# EAGLE schematic ESP32 Display 3.5 inch V1.2(1) (EAGLE 9.6.2)
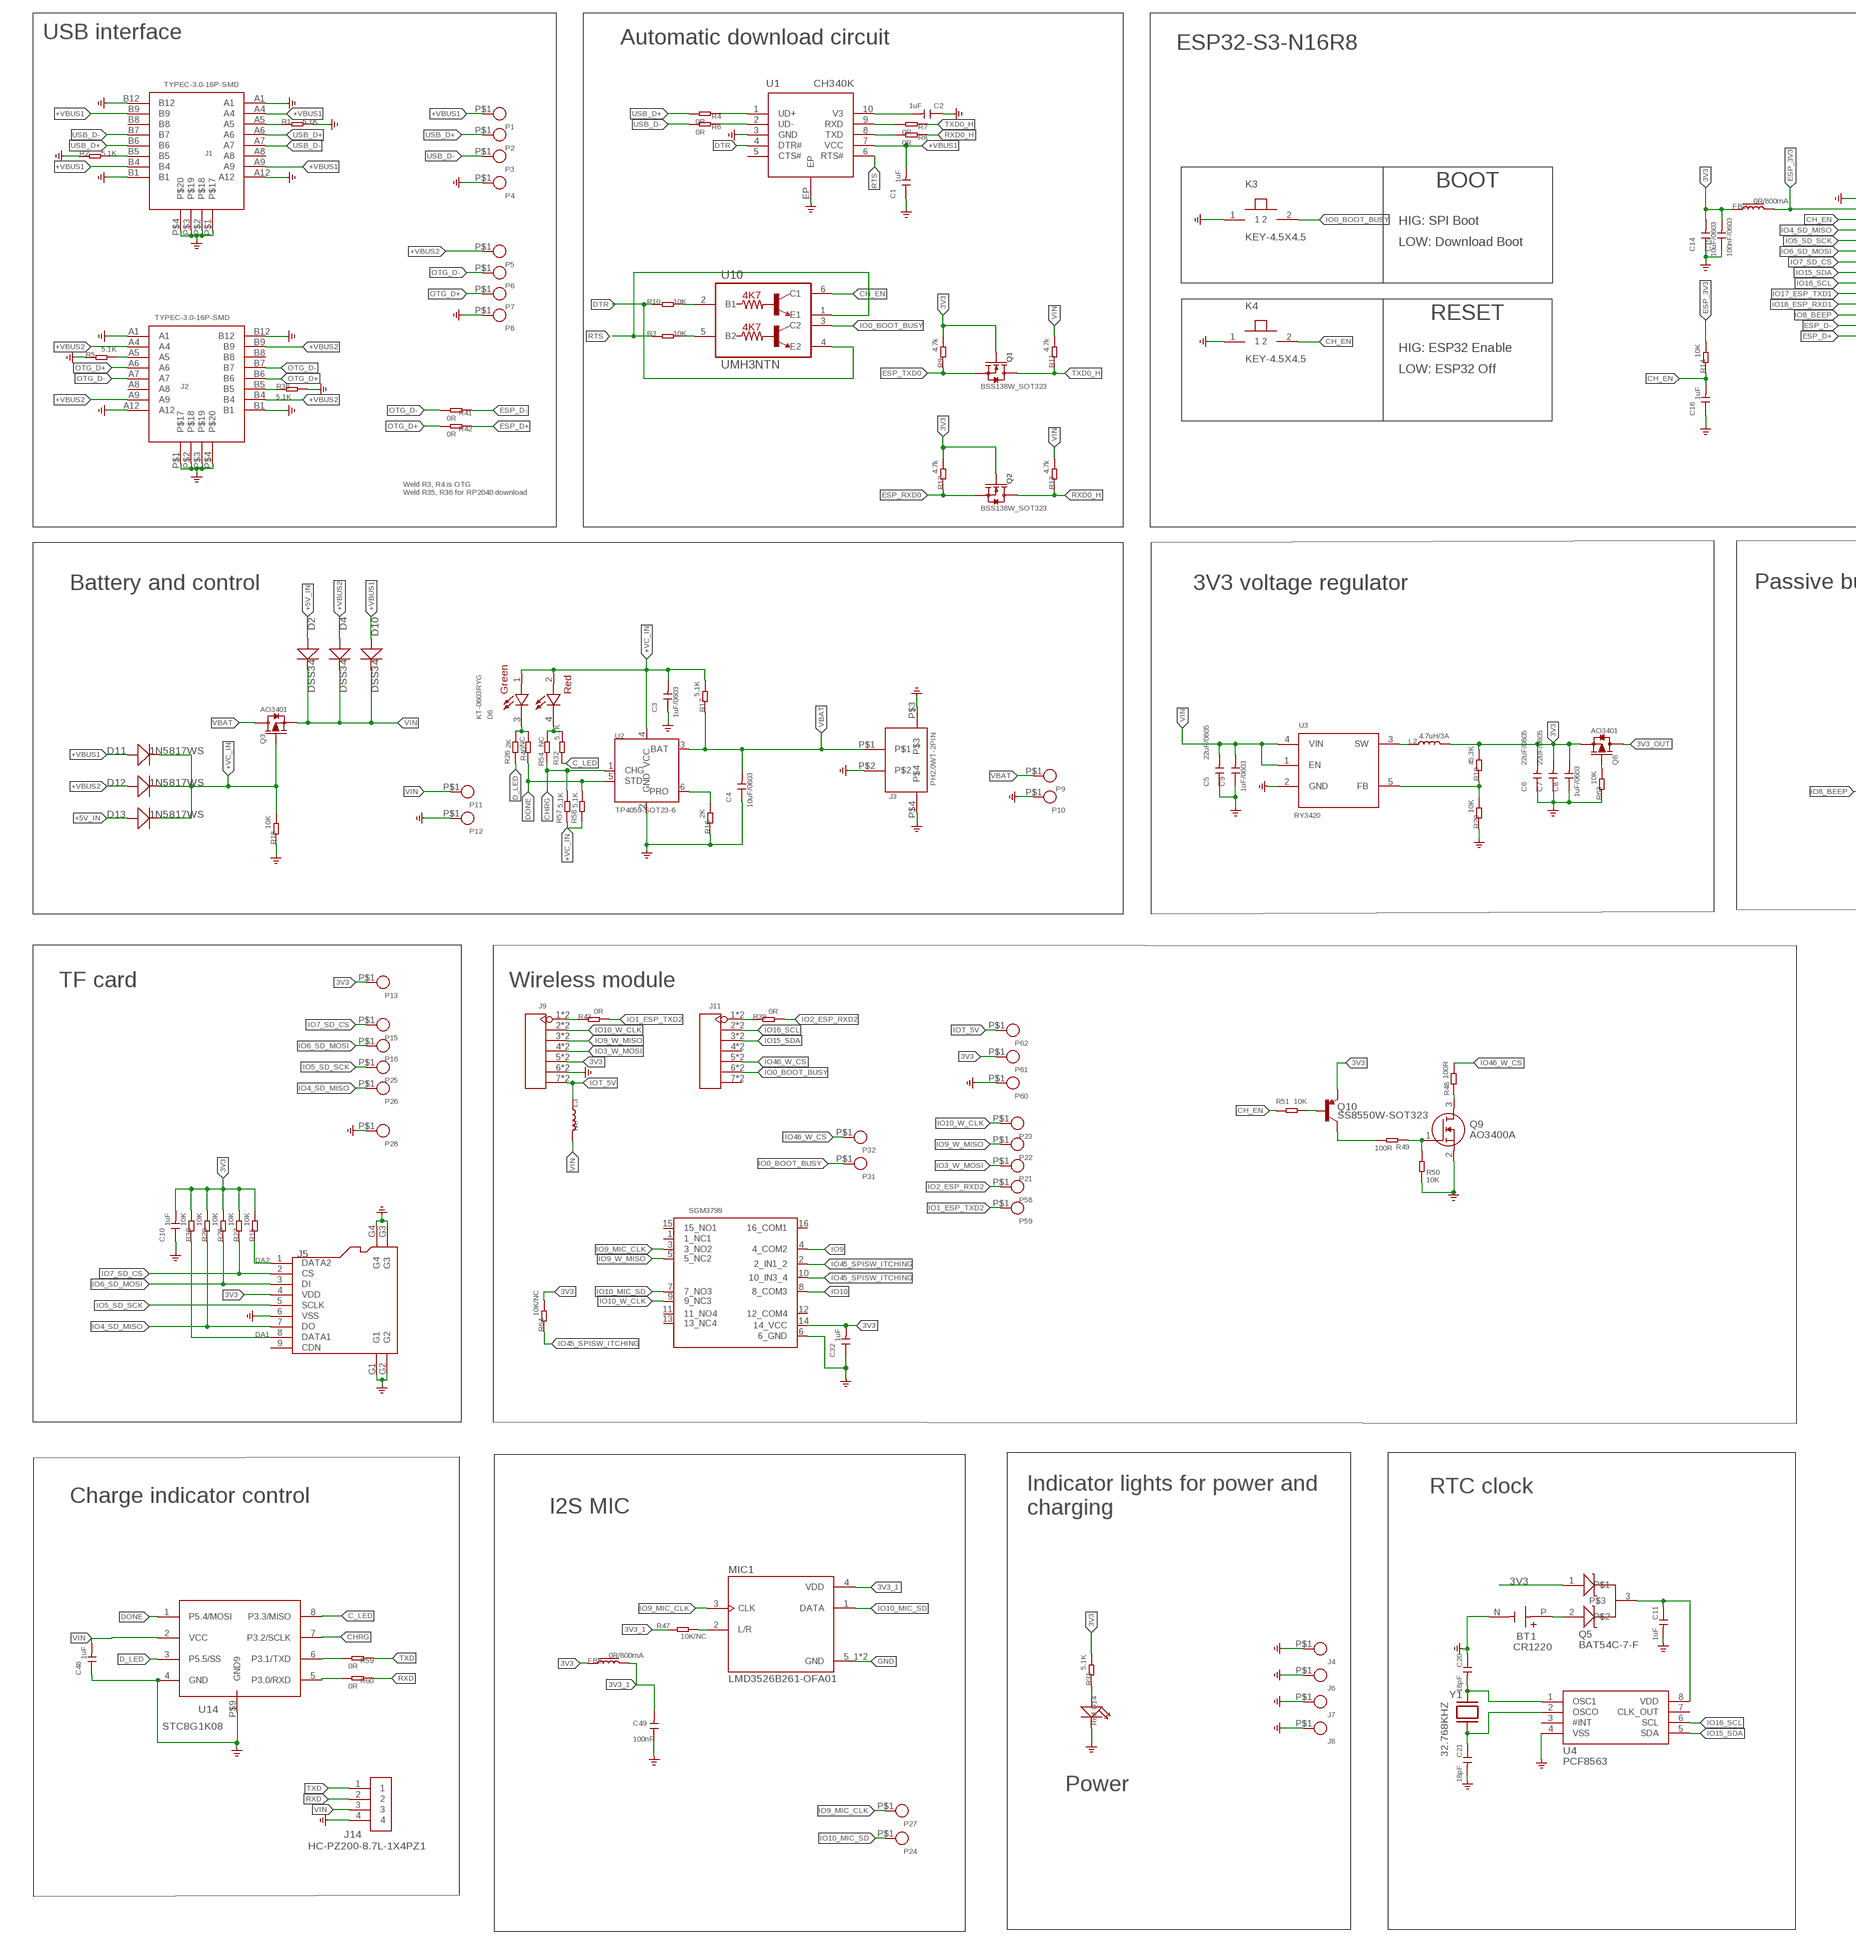
[diagram p0: schematic, sheet 1, part 1 of 3]
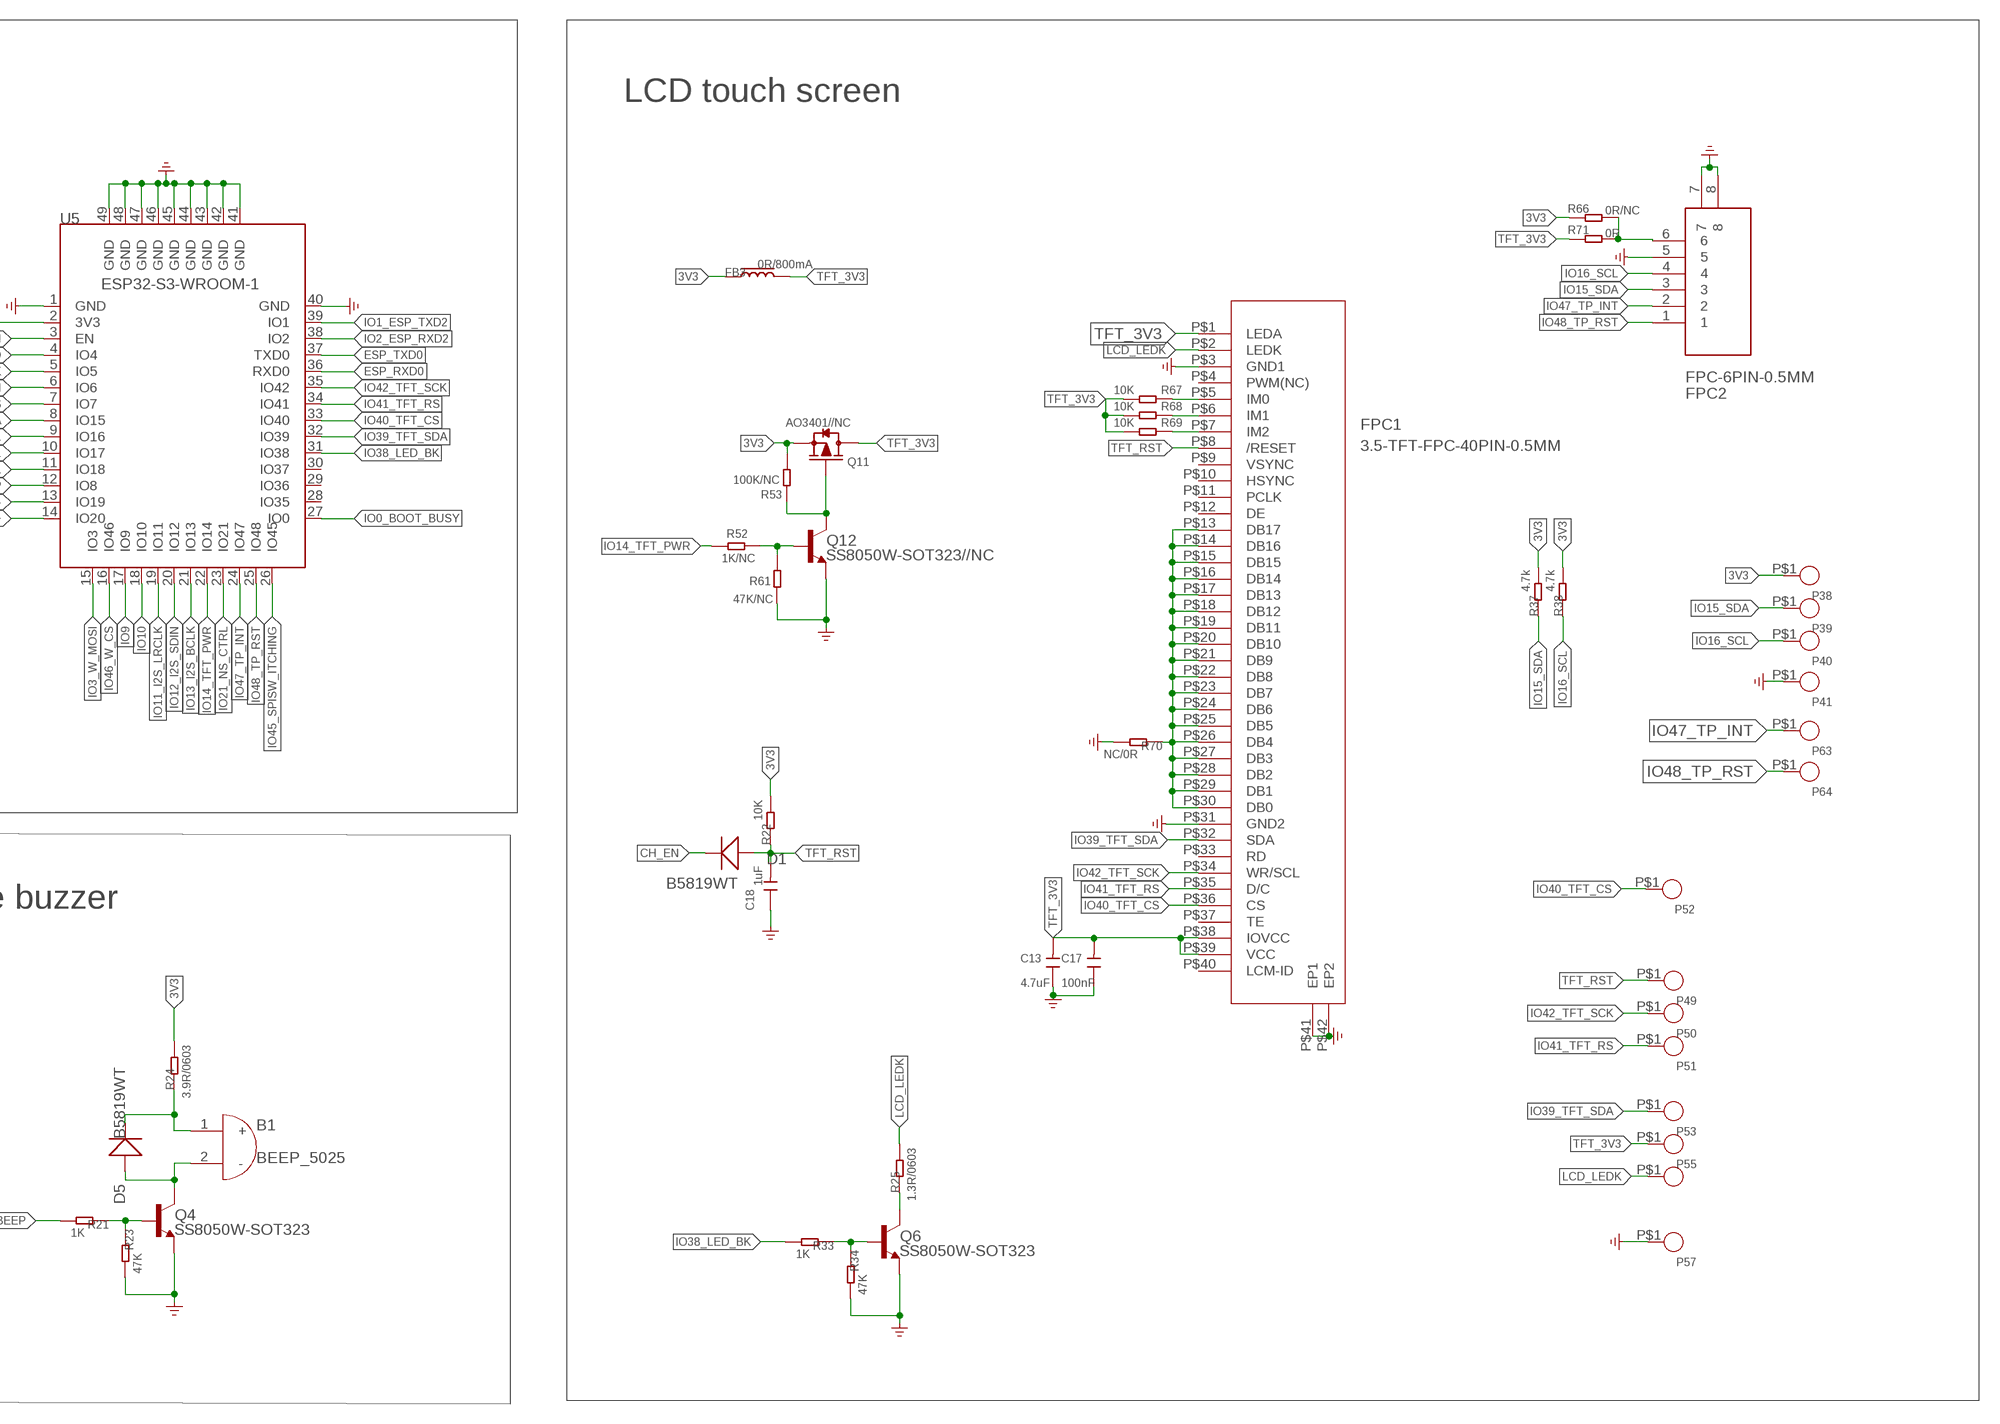
[diagram p1: schematic, sheet 1, part 2 of 3]
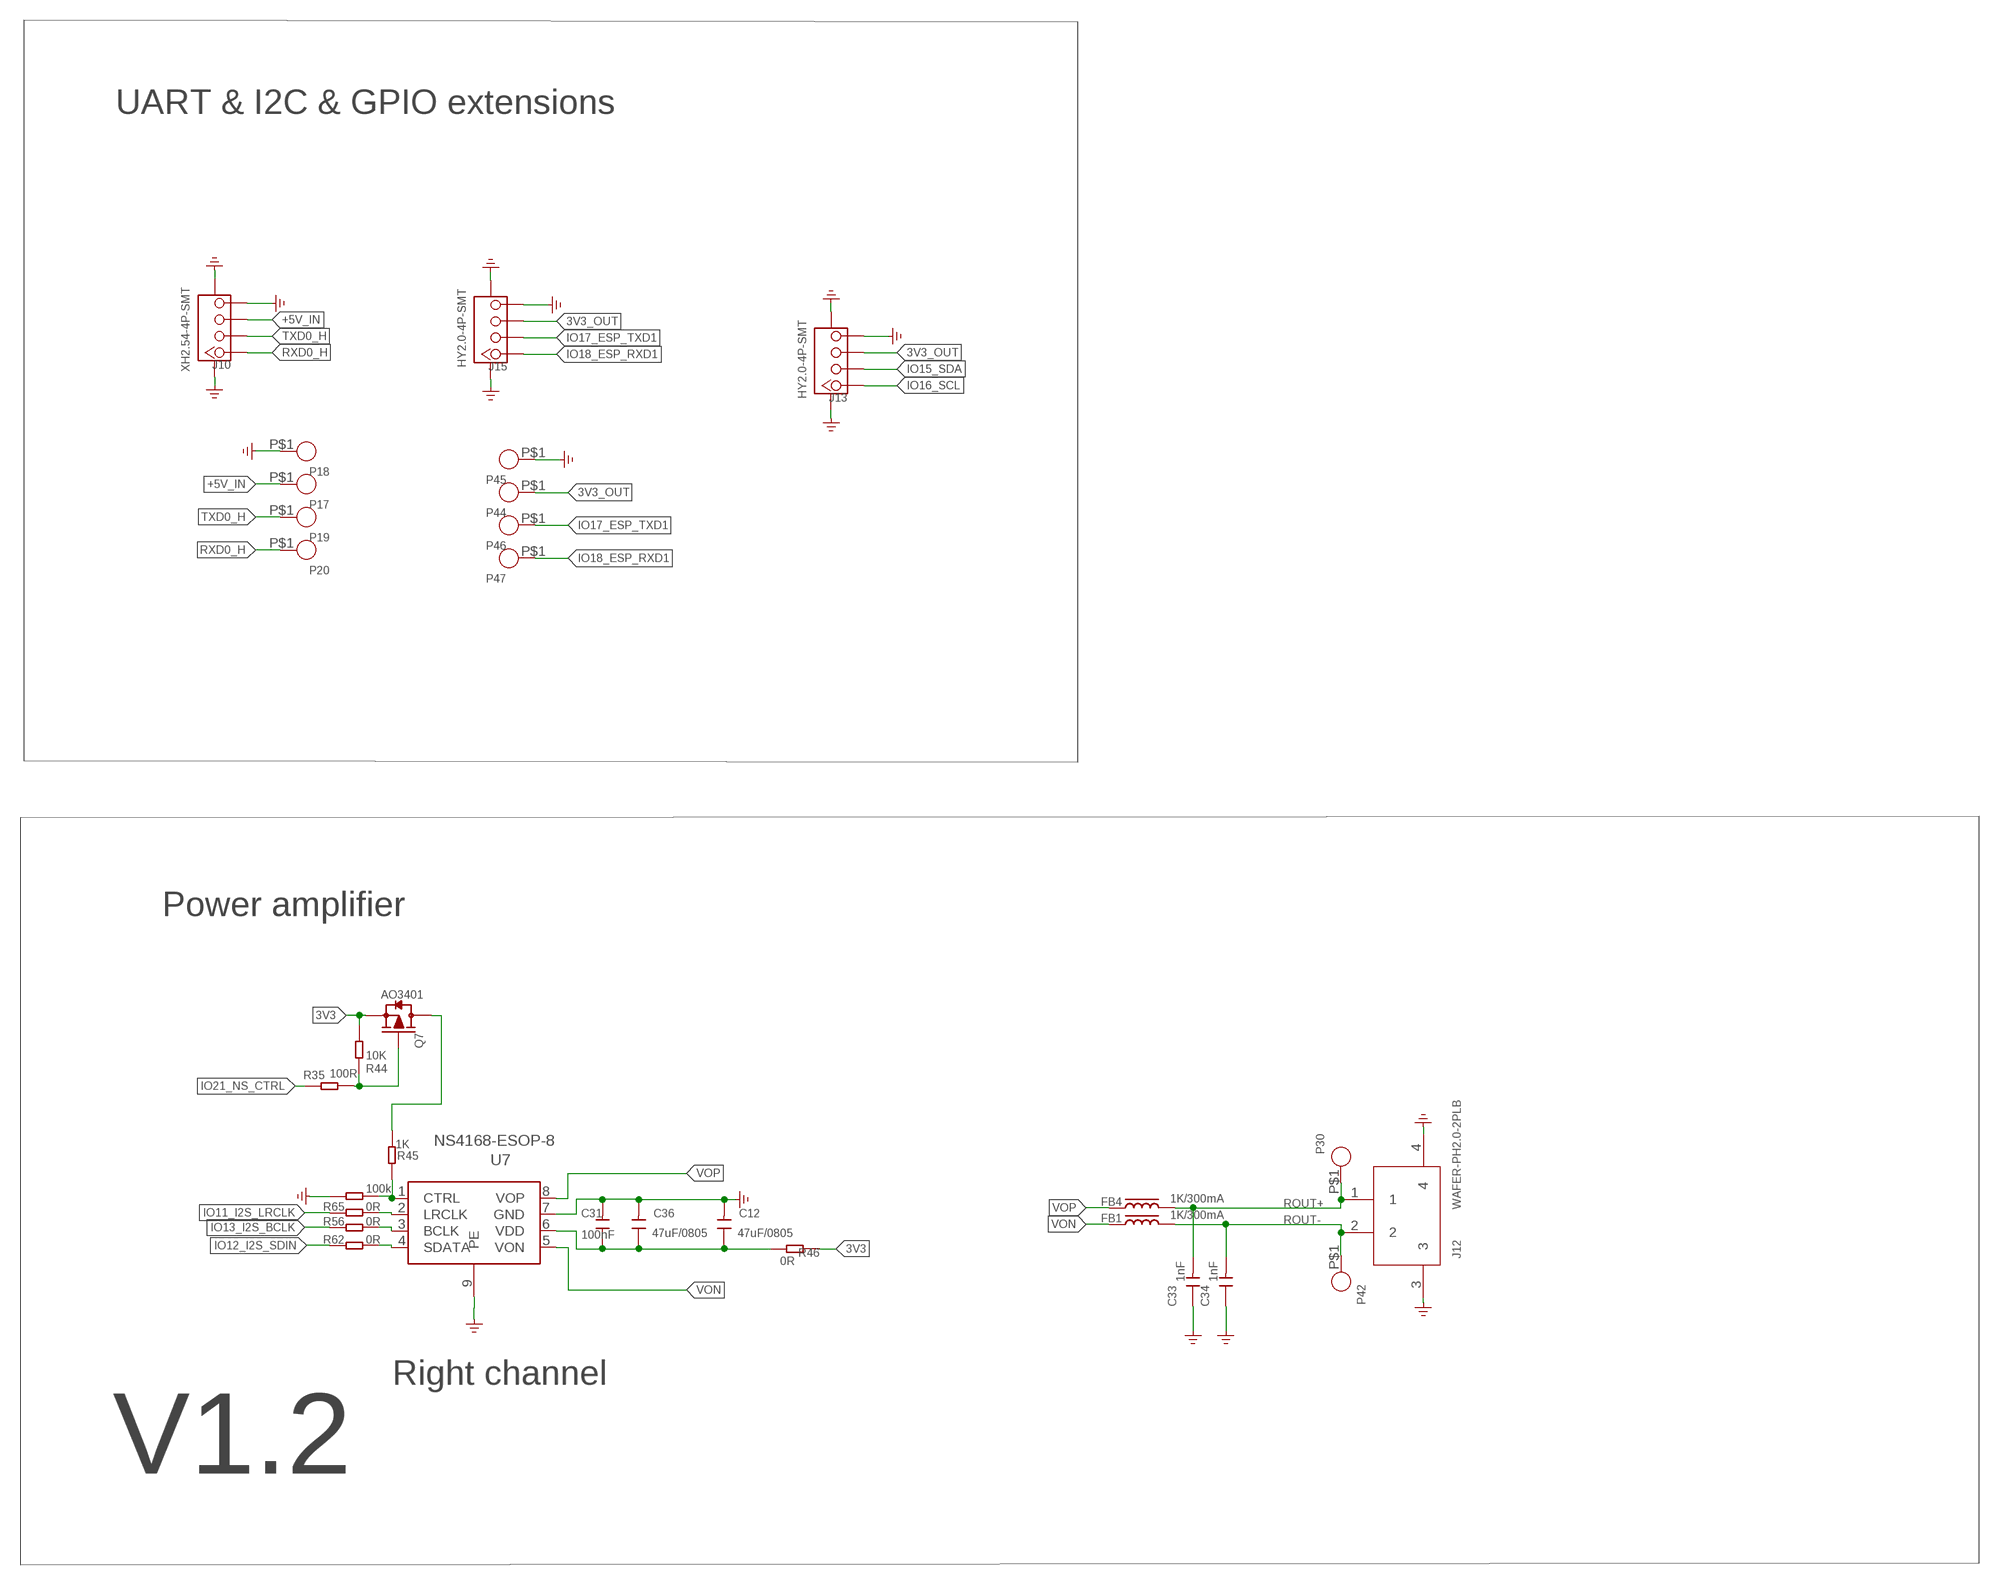
[diagram p2: schematic, sheet 1, part 3 of 3]

## Parts
B1  BEEP_5025  [BEEP_5025]
BT1  CR1220  [CR1220]
C1  1uF  CAPC0402-1  [C0402]
C2  1uF  CAPC0402-1  [C0402]
C3  1uF/0603  CAP  [C0603]
C4  10uF/0603  CAP  [C0603]
C5  22uF/0805  CAPC0805  [C0805]
C6  22uF/0805  CAPC0805  [C0805]
C7  22uF/0805  CAPC0805  [C0805]
C8  1uF/0603  CAP  [C0603]
C9  1uF/0603  CAP  [C0603]
C10  1uF  CAPC0402-1  [C0402]
C11  1uF  CAPC0402-1  [C0402]
C12  47uF/0805  CAPC0805  [C0805]
C13  4.7uF  CAP  [C0603]
C14  10uF/0603  CAP  [C0603]
C15  100nF/0603  CAP  [C0603]
C16  1uF  CAPC0402-1  [C0402]
C17  100nF  CAP  [C0603]
C18  1uF  CAPC0402-1  [C0402]
C20  18pF  CAPC0402-1  [C0402]
C21  18pF  CAPC0402-1  [C0402]
C31  100nF  CAPC0402-1  [C0402]
C32  1uF  CAPC0402-1  [C0402]
C33  1nF  CAPC0402-1  [C0402]
C34  1nF  CAPC0402-1  [C0402]
C36  47uF/0805  CAPC0805  [C0805]
C48  1uF  CAPC0402-1  [C0402]
C49  100nF  CAP  [C0603]
D1  B5819WT  DIODE0603  [D_SOD523]
D2  DSS34  DIODE  [D_SOD123FL]
D4  DSS34  DIODE  [D_SOD123FL]
D5  B5819WT  DIODE0603  [D_SOD523]
D6  KT-0603RYG  [LED_KT-0603RYG]
D10  DSS34  DIODE  [D_SOD123FL]
D11  1N5817WS  DIODE0805  [D_SOD323]
D12  1N5817WS  DIODE0805  [D_SOD323]
D13  1N5817WS  DIODE0805  [D_SOD323]
D14  Red  LED-SMT0603  [LED0603]
FB1  1K/300mA  FBL0603  [L0603]
FB2  0R/800mA  FBL0603  [L0603]
FB3  0R/800mA  FBL0603  [L0603]
FB4  1K/300mA  FBL0603  [L0603]
FB5  0R/800mA  FBL0603  [L0603]
FPC1  3.5-TFT-FPC-40PIN-0.5MM  [COOPER_0.5MM*40P]
FPC2  FPC-6PIN-0.5MM  [FPC-6PIN-0.5MM]
J1  TYPEC-3.0-16P-SMD  [USB-3.0TYPEC-SMD]
J2  TYPEC-3.0-16P-SMD  [USB-3.0TYPEC-SMD]
J3  PH2.0WT-2PIN  [PH2.0WT-2PIN]
J4  THO-M3.25MM-HOLE  [THO-M3.2*5MM-HOLE]
J5  HOLDER-MICROSD-9P  [9P-SMD-W/-RING]
J6  THO-M3.25MM-HOLE  [THO-M3.2*5MM-HOLE]
J7  THO-M3.25MM-HOLE  [THO-M3.2*5MM-HOLE]
J8  THO-M3.25MM-HOLE  [THO-M3.2*5MM-HOLE]
J9  HEADER-7P-18.28X2.5  [H7-2.54-18.28X2.5X5MM]
J10  XH2.54-4P-SMT  [XH2.54-4P-SMD]
J11  HEADER-7P-18.28X2.5  [H7-2.54-18.28X2.5X5MM]
J12  WAFER-PH2.0-2PLB  [CONN-TH_2P-P2.00_XUNPU_WAFER-PH2.0-2PLB]
J13  HY2.0-4P-SMT  CONNECTOR_TWIG-4P-2.0-SMD-FEMALE-REINFORCEDD  [CONNECTOR_4P-SMD-2.0]
J14  HC-PZ200-8.7L-1X4PZ1  [TEST-PIN-4-2.0MM]
J15  HY2.0-4P-SMT  CONNECTOR_TWIG-4P-2.0-SMD-FEMALE-REINFORCEDD  [CONNECTOR_4P-SMD-2.0]
K3  KEY-4.5X4.5  KEY-6KEY-4.5X4.5  [KEY-4.5X4.5-SMD]
K4  KEY-4.5X4.5  KEY-6KEY-4.5X4.5  [KEY-4.5X4.5-SMD]
L2  4.7uH/3A  LL0420  [L0420]
L3  NC  L0603  [L0603]
MIC1  LMD3526B261-OFA01  LMD3526B261-OFA03  [MIC-SMD_5P-L3.5-W2.7-P1.67]
P1  TEST_PADPAD-1.5MM  [TEST_PAD-1.5MM]
P2  TEST_PADPAD-1.5MM  [TEST_PAD-1.5MM]
P3  TEST_PADPAD-1.5MM  [TEST_PAD-1.5MM]
P4  TEST_PADPAD-1.5MM  [TEST_PAD-1.5MM]
P5  TEST_PADPAD-1.5MM  [TEST_PAD-1.5MM]
P6  TEST_PADPAD-1.5MM  [TEST_PAD-1.5MM]
P7  TEST_PADPAD-1.5MM  [TEST_PAD-1.5MM]
P8  TEST_PADPAD-1.5MM  [TEST_PAD-1.5MM]
P9  TEST_PADPAD-1.5MM  [TEST_PAD-1.5MM]
P10  TEST_PADPAD-1.5MM  [TEST_PAD-1.5MM]
P11  TEST_PADPAD-1.5MM  [TEST_PAD-1.5MM]
P12  TEST_PADPAD-1.5MM  [TEST_PAD-1.5MM]
P13  TEST_PADPAD-1.5MM  [TEST_PAD-1.5MM]
P15  TEST_PADPAD-1.5MM  [TEST_PAD-1.5MM]
P16  TEST_PADPAD-1.5MM  [TEST_PAD-1.5MM]
P17  TEST_PADPAD-1.5MM  [TEST_PAD-1.5MM]
P18  TEST_PADPAD-1.5MM  [TEST_PAD-1.5MM]
P19  TEST_PADPAD-1.5MM  [TEST_PAD-1.5MM]
P20  TEST_PADPAD-1.5MM  [TEST_PAD-1.5MM]
P21  TEST_PADPAD-1.5MM  [TEST_PAD-1.5MM]
P22  TEST_PADPAD-1.5MM  [TEST_PAD-1.5MM]
P23  TEST_PADPAD-1.5MM  [TEST_PAD-1.5MM]
P24  TEST_PADPAD-1.5MM  [TEST_PAD-1.5MM]
P25  TEST_PADPAD-1.5MM  [TEST_PAD-1.5MM]
P26  TEST_PADPAD-1.5MM  [TEST_PAD-1.5MM]
P27  TEST_PADPAD-1.5MM  [TEST_PAD-1.5MM]
P28  TEST_PADPAD-1.5MM  [TEST_PAD-1.5MM]
P30  TEST_PADPAD-1.5MM  [TEST_PAD-1.5MM]
P31  TEST_PADPAD-1.5MM  [TEST_PAD-1.5MM]
P32  TEST_PADPAD-1.5MM  [TEST_PAD-1.5MM]
P38  TEST_PADPAD-1.5MM  [TEST_PAD-1.5MM]
P39  TEST_PADPAD-1.5MM  [TEST_PAD-1.5MM]
P40  TEST_PADPAD-1.5MM  [TEST_PAD-1.5MM]
P41  TEST_PADPAD-1.5MM  [TEST_PAD-1.5MM]
P42  TEST_PADPAD-1.5MM  [TEST_PAD-1.5MM]
P44  TEST_PADPAD-1.5MM  [TEST_PAD-1.5MM]
P45  TEST_PADPAD-1.5MM  [TEST_PAD-1.5MM]
P46  TEST_PADPAD-1.5MM  [TEST_PAD-1.5MM]
P47  TEST_PADPAD-1.5MM  [TEST_PAD-1.5MM]
P49  TEST_PADPAD-1.5MM  [TEST_PAD-1.5MM]
P50  TEST_PADPAD-1.5MM  [TEST_PAD-1.5MM]
P51  TEST_PADPAD-1.5MM  [TEST_PAD-1.5MM]
P52  TEST_PADPAD-1.5MM  [TEST_PAD-1.5MM]
P53  TEST_PADPAD-1.5MM  [TEST_PAD-1.5MM]
P55  TEST_PADPAD-1.5MM  [TEST_PAD-1.5MM]
P56  TEST_PADPAD-1.5MM  [TEST_PAD-1.5MM]
P57  TEST_PADPAD-1.5MM  [TEST_PAD-1.5MM]
P58  TEST_PADPAD-1.5MM  [TEST_PAD-1.5MM]
P59  TEST_PADPAD-1.5MM  [TEST_PAD-1.5MM]
P60  TEST_PADPAD-1.5MM  [TEST_PAD-1.5MM]
P61  TEST_PADPAD-1.5MM  [TEST_PAD-1.5MM]
P62  TEST_PADPAD-1.5MM  [TEST_PAD-1.5MM]
P63  TEST_PADPAD-1.5MM  [TEST_PAD-1.5MM]
P64  TEST_PADPAD-1.5MM  [TEST_PAD-1.5MM]
Q1  BSS138W_SOT323  MOSFET-NSI1304BDL  [MOS_SOT323]
Q2  BSS138W_SOT323  MOSFET-NSI1304BDL  [MOS_SOT323]
Q3  AO3401  MOSFET-PSOT23  [PMOS_SOT23]
Q4  SS8050W-SOT323  TRANS_NPN  [MOS_SOT323]
Q5  BAT54C-7-F  [SOT-23]
Q6  SS8050W-SOT323  TRANS_NPN  [MOS_SOT323]
Q7  AO3401  MOSFET-PSOT23  [PMOS_SOT23]
Q8  AO3401  MOSFET-PSOT23  [PMOS_SOT23]
Q9  AO3400A  [SOT95P280X125-3N]
Q10  SS8550W-SOT323  TRANS_PNP  [MOS_SOT323]
Q11  AO3401//NC  MOSFET-PSOT23  [PMOS_SOT23]
Q12  SS8050W-SOT323//NC  TRANS_NPN  [MOS_SOT323]
R1  5.1K  RES-0402  [R0402]
R2  5.1K  RES-0402  [R0402]
R3  10K  RES-0402  [R0402]
R4  0R  RES-0402  [R0402]
R5  5.1K  RES-0402  [R0402]
R6  0R  RES-0402  [R0402]
R7  0R  RES-0402  [R0402]
R8  0R  RES-0402  [R0402]
R9  4.7k  RES-0402  [R0402]
R10  10K  RES-0402  [R0402]
R11  4.7k  RES-0402  [R0402]
R12  4.7k  RES-0402  [R0402]
R13  4.7k  RES-0402  [R0402]
R14  10K  RES-0402  [R0402]
R15  10K  RES-0402  [R0402]
R16  2K  RES-0402  [R0402]
R17  5.1K  RES-0402  [R0402]
R18  10K  RES-0402  [R0402]
R19  45.3K  RES-0402  [R0402]
R20  10K  RES-0402  [R0402]
R21  1K  RES-0402  [R0402]
R22  10K  RES-0402  [R0402]
R23  47K  RES-0402  [R0402]
R24  3.9R/0603  RES-0603  [R0603-SP]
R25  1.3R/0603  RES-0603  [R0603-SP]
R26  2K  RES-0402  [R0402]
R27  10K  RES-0402  [R0402]
R28  10K  RES-0402  [R0402]
R29  10K  RES-0402  [R0402]
R30  10K  RES-0402  [R0402]
R31  5.1K  RES-0402  [R0402]
R32  5.1K  RES-0402  [R0402]
R33  1K  RES-0402  [R0402]
R34  47K  RES-0402  [R0402]
R35  100R  RES-0402  [R0402]
R36  5.1K  RES-0402  [R0402]
R37  4.7k  RES-0402  [R0402]
R38  4.7k  RES-0402  [R0402]
R39  0R  RES-0402  [R0402]
R40  NC  RES-0402  [R0402]
R41  0R  RES-0402  [R0402]
R42  0R  RES-0402  [R0402]
R43  0R  RES-0402  [R0402]
R44  10K  RES-0402  [R0402]
R45  1K  RES-0402  [R0402]
R46  0R  RES-0402  [R0402]
R47  10K/NC  RES-0402  [R0402]
R48  100R  RES-0402  [R0402]
R49  100R  RES-0402  [R0402]
R50  10K  RES-0402  [R0402]
R51  10K  RES-0402  [R0402]
R52  1K/NC  RES-0402  [R0402]
R53  100K/NC  RES-0402  [R0402]
R54  NC  RES-0402  [R0402]
R55  100k  RES-0402  [R0402]
R56  0R  RES-0402  [R0402]
R57  5.1K  RES-0402  [R0402]
R58  5.1K  RES-0402  [R0402]
R59  0R  RES-0402  [R0402]
R60  0R  RES-0402  [R0402]
R61  47K/NC  RES-0402  [R0402]
R62  0R  RES-0402  [R0402]
R63  10K  RES-0402  [R0402]
R64  10K/NC  RES-0402  [R0402]
R65  0R  RES-0402  [R0402]
R66  0R/NC  RES-0402  [R0402]
R67  10K  RES-0402  [R0402]
R68  10K  RES-0402  [R0402]
R69  10K  RES-0402  [R0402]
R70  NC/0R  RES-0402  [R0402]
R71  0R  RES-0402  [R0402]
U1  CH340K  [ESOP-10-EP-150MIL]
U2  TP4059-SOT23-6  [SOT23-6L]
U3  RY3420  HM3416H  [IC_SOT23-5]
U4  PCF8563  BM8563EMA  [MSOP-8]
U5  ESP32-S3-WROOM-1  [ESP32-S3-WROOM-1-SMD41]
U7  NS4168-ESOP-8  [NS4168-ESOP-8]
U8  SGM3799  IC_SGM3799_TQFN2.6X1.8_16L  [IC_SGM3799_TQFN2.6X1.8_16L]
U10  UMH3NTN  [SOP65P210X100-6N]
U14  STC8G1K08  [DFN8]
Y1  32.768KHZ  [SMD3215-2P]

## Nets
3V3: C6.2 C7.2 C8.2 C10.2 C14.2 C15.2 C32.2 FB2.1 FB3.1 FB5.1 J5.4(VDD) J9.5 J9.5-5 L2.2 P13.P$1 P38.P$1 P61.P$1 Q1.1(G) Q2.1(G) Q5.1 Q7.2(S) Q8.2(S) Q10.2(E) Q11.2(S) R9.2 R12.2 R15.2 R19.2 R22.2 R24.2 R27.2 R28.2 R29.2 R30.2 R31.2 R37.2 R38.2 R44.2 R46.1 R53.2 R64.2 R66.2 U8.14(14_VCC)
3V3_1: C49.2 FB5.2 MIC1.4(VDD) R47.2
3V3_OUT: J13.3 J15.3 P44.P$1 Q8.3(D)
+5V_IN: D2.+ D13.+ J10.3 P17.P$1
+VBUS1: C1.2 D10.+ D11.+ J1.A4 J1.A9 J1.B4 J1.B9 P1.P$1 U1.7(VCC)
+VBUS2: D4.+ D12.+ J2.A4 J2.A9 J2.B4 J2.B9 P5.P$1
+VC_IN: C3.2 D6.1 D6.2 D11.- D12.- D13.- Q3.1(G) R17.2 R18.2 R57.1 R58.1 U2.4(VCC)
C_LED: R32.1 U14.8(P3.3/MISO)
CH_EN: C16.2 D1.- K4.2 R14.1 R51.1 U5.3(EN) U10.6(C1)
CHRG: R54.1 R57.2 U2.1(CHG) U14.7(P3.2/SCLK)
D_LED: R26.1 U14.3(P5.5/SS)
DA1: J5.8(DATA1) R30.1
DA2: J5.1(DATA2) R15.1
DONE: R40.1 R58.2 U2.5(STD) U14.1(P5.4/MOSI)
DTR: R10.2 U1.4(DTR#) U10.4(E2)
ESP_3V3: FB2.2 R14.2 U5.2(3V3)
ESP_D+: R42.1 U5.14(IO20)
ESP_D-: R41.1 U5.13(IO19)
ESP_RXD0: Q2.2(S) R12.1 U5.36(RXD0)
ESP_TXD0: Q1.2(S) R9.1 U5.37(TXD0)
GND: BT1.N(-) C1.1 C2.1 C3.1 C4.1 C5.1 C6.1 C7.1 C8.1 C9.1 C10.1 C11.2 C12.2 C13.1 C14.1 C15.1 C16.1 C17.1 C18.1 C20.1 C21.2 C31.2 C32.1 C33.1 C34.1 C36.2 C48.1 C49.1 D14.- FPC1.P$3(GND1) FPC1.P$31(GND2) FPC1.P$41(EP1) FPC1.P$42(EP2) FPC2.5 FPC2.7 FPC2.8 J1.A1 J1.A12 J1.B1 J1.B12 J1.P$1 J1.P$2 J1.P$3 J1.P$4 J2.A1 J2.A12 J2.B1 J2.B12 J2.P$1 J2.P$2 J2.P$3 J2.P$4 J3.P$2 J3.P$3 J3.P$4 J4.P$1 J5.6(VSS) J5.G1 J5.G2 J5.G3 J5.G4 J6.P$1 J7.P$1 J8.P$1 J9.6 J9.6-6 J10.4 J10.5(SS1) J10.6(SS2) J12.3 J12.4 J13.4 J13.SS1 J13.SS2 J14.4 J15.4 J15.SS1 J15.SS2 K3.1 K4.1 MIC1.5_1(GND) MIC1.5_2(GND) P4.P$1 P8.P$1 P10.P$1 P12.P$1 P18.P$1 P28.P$1 P41.P$1 P45.P$1 P57.P$1 P60.P$1 Q4.2(E) Q6.2(E) Q9.2(S) Q12.2(E) R1.2 R2.1 R5.1 R16.1 R18.1 R20.1 R23.2 R34.2 R36.2 R50.2 R55.2 R61.2 R63.1 R70.2 U1.3(GND) U1.EP U2.2(GND) U3.2(GND) U4.4(VSS) U5.1(GND) U5.40(GND) U5.41(GND) U5.42(GND) U5.43(GND) U5.44(GND) U5.45(GND) U5.46(GND) U5.47(GND) U5.48(GND) U5.49(GND) U7.7(GND) U7.9(PE) U8.6(6_GND) U14.4(GND) U14.P$9(GND9)
IO0_BOOT_BUSY: J11.6 J11.6-6 K3.2 P31.P$1 U5.27(IO0) U10.3(C2)
IO1_ESP_TXD2: P59.P$1 R43.2 U5.39(IO1)
IO2_ESP_RXD2: P58.P$1 R39.2 U5.38(IO2)
IO3_W_MOSI: J9.4 J9.4-4 P21.P$1 U5.15(IO3)
IO4_SD_MISO: J5.7(DO) P26.P$1 R29.1 U5.4(IO4)
IO5_SD_SCK: J5.5(SCLK) P25.P$1 U5.5(IO5)
IO6_SD_MOSI: J5.3(DI) P16.P$1 R28.1 U5.6(IO6)
IO7_SD_CS: J5.2(CS) P15.P$1 R27.1 U5.7(IO7)
IO8_BEEP: R21.2 U5.12(IO8)
IO9: U5.17(IO9) U8.4(4_COM2)
IO9_MIC_CLK: MIC1.3(CLK) P27.P$1 U8.3(3_NO2)
IO9_W_MISO: J9.3 J9.3-3 P22.P$1 U8.5(5_NC2)
IO10: U5.18(IO10) U8.8(8_COM3)
IO10_MIC_SD: MIC1.1(DATA) P24.P$1 U8.7(7_NO3)
IO10_W_CLK: J9.2 J9.2-2 P23.P$1 U8.9(9_NC3)
IO11_I2S_LRCLK: R65.2 U5.19(IO11)
IO12_I2S_SDIN: R62.2 U5.20(IO12)
IO13_I2S_BCLK: R56.2 U5.21(IO13)
IO14_TFT_PWR: R52.2 U5.22(IO14)
IO15_SDA: FPC2.3 J11.3 J11.3-3 J13.2 P39.P$1 R37.1 U4.5(SDA) U5.8(IO15)
IO16_SCL: FPC2.4 J11.2 J11.2-2 J13.1 P40.P$1 R38.1 U4.6(SCL) U5.9(IO16)
IO17_ESP_TXD1: J15.2 P46.P$1 U5.10(IO17)
IO18_ESP_RXD1: J15.1 P47.P$1 U5.11(IO18)
IO21_NS_CTRL: R35.1 U5.23(IO21)
IO38_LED_BK: R33.2 U5.31(IO38)
IO39_TFT_SDA: FPC1.P$32(SDA) P53.P$1 U5.32(IO39)
IO40_TFT_CS: FPC1.P$36(CS) P52.P$1 U5.33(IO40)
IO41_TFT_RS: FPC1.P$35(D/C) P51.P$1 U5.34(IO41)
IO42_TFT_SCK: FPC1.P$34(WR/SCL) P50.P$1 U5.35(IO42)
IO45_SPISW_ITCHING: R64.1 U5.26(IO45) U8.2(2_IN1_2) U8.10(10_IN3_4)
IO46_W_CS: J11.5 J11.5-5 P32.P$1 R48.2 U5.16(IO46)
IO47_TP_INT: FPC2.2 P63.P$1 U5.24(IO47)
IO48_TP_RST: FPC2.1 P64.P$1 U5.25(IO48)
IOT_5V: J9.7 J9.7-7 L3.1 P62.P$1
LCD_LEDK: FPC1.P$2(LEDK) P56.P$1 R25.2
N$1: J1.A5 R1.1
N$2: Q7.1(G) R35.2 R44.1
N$3: J2.B5 R36.1
N$4: J2.A5 R5.2
N$5: R4.1 U1.1(UD+)
N$6: R6.1 U1.2(UD-)
N$7: R10.1 U10.2(B1)
N$8: R3.1 U10.5(B2)
N$9: C2.2 U1.10(V3)
N$10: R7.2 U1.9(RXD)
N$11: R8.2 U1.8(TXD)
N$12: R16.2 U2.6(PRO)
N$13: L2.1 U3.3(SW)
N$14: Q4.1(B) R21.1 R23.1
N$15: B1.2(-) D5.+ Q4.3(C)
N$16: B1.1(+) D5.- R24.1
N$17: MIC1.2(L/R) R47.1
N$18: BT1.P(+) Q5.2
N$19: R59.2 U14.6(P3.1/TXD)
N$20: R60.2 U14.5(P3.0/RXD)
N$21: D14.+ R31.1
N$22: Q6.3(C) R25.1
N$23: J9.1 J9.1-1 R43.1
N$24: J11.1 J11.1-1 R39.1
N$25: C11.1 Q5.3 U4.8(VDD)
N$26: C21.1 U4.2(OSCO) Y1.2
N$27: Q8.1(G) R63.2
N$28: Q9.1(G) R49.1 R50.1
N$29: Q6.1(B) R33.1 R34.1
N$30: C20.2 U4.1(OSC1) Y1.1
N$31: R19.1 R20.2 U3.5(FB)
N$32: Q10.3(C) R49.2
N$33: FPC1.P$5(IM0) R67.1
N$34: Q10.1(B) R51.2
N$35: Q11.1(G) Q12.3(C) R53.1
N$36: Q12.1(B) R52.1 R61.1
N$37: FPC2.6 R66.1 R71.1
N$39: R65.1 U7.2(LRCLK)
N$40: D6.3 R26.2 R40.2
N$41: FPC1.P$6(IM1) R68.1
N$42: FPC1.P$7(IM2) R69.1
N$43: D6.4 R32.2 R54.2
N$44: FPC1.P$13(DB17) FPC1.P$14(DB16) FPC1.P$15(DB15) FPC1.P$16(DB14) FPC1.P$17(DB13) FPC1.P$18(DB12) FPC1.P$19(DB11) FPC1.P$20(DB10) FPC1.P$21(DB9) FPC1.P$22(DB8) FPC1.P$23(DB7) FPC1.P$24(DB6) FPC1.P$25(DB5) FPC1.P$26(DB4) FPC1.P$27(DB3) FPC1.P$28(DB2) FPC1.P$29(DB1) FPC1.P$30(DB0) R70.1
N$46: R56.1 U7.3(BCLK)
N$47: R62.1 U7.4(SDATA)
N$49: C12.1 C31.1 C36.1 R46.2 U7.6(VDD)
N$51: J1.B5 R2.2
N$235: Q9.3(D) R48.1
NS_3V3: Q7.3(D) R45.1
NS_CTRL: R45.2 R55.1 U7.1(CTRL)
OTG_D+: J2.A6 J2.B6 P7.P$1 R42.2
OTG_D-: J2.A7 J2.B7 P6.P$1 R41.2
ROUT+: C33.2 FB4.2 J12.1 P30.P$1
ROUT-: C34.2 FB1.2 J12.2 P42.P$1
RTS: R3.2 U1.6(RTS#) U10.1(E1)
RXD: J14.2 R60.1
RXD0_H: J10.1 P20.P$1 Q2.3(D) R8.1 R13.1
TFT_3V3: C13.2 C17.2 FB3.2 FPC1.P$1(LEDA) FPC1.P$38(IOVCC) FPC1.P$39(VCC) P55.P$1 Q11.3(D) R67.2 R68.2 R69.2 R71.2
TFT_RST: C18.2 D1.+ FPC1.P$8(/RESET) P49.P$1 R22.1
TXD: J14.1 R59.1
TXD0_H: J10.2 P19.P$1 Q1.3(D) R7.1 R11.1
USB_D+: J1.A6 J1.B6 P2.P$1 R4.2
USB_D-: J1.A7 J1.B7 P3.P$1 R6.2
VBAT: C4.2 J3.P$1 P9.P$1 Q3.3(D) R17.1 U2.3(BAT)
VIN: C5.2 C9.2 C48.2 D2.- D4.- D10.- J14.3 L3.2 P11.P$1 Q3.2(S) R11.2 R13.2 U3.1(EN) U3.4(VIN) U14.2(VCC)
VON: FB1.1 U7.5(VON)
VOP: FB4.1 U7.8(VOP)
Unconnected: FPC1.P$4(PWM(NC)) FPC1.P$9(VSYNC) FPC1.P$10(HSYNC) FPC1.P$11(PCLK) FPC1.P$12(DE) FPC1.P$33(RD) FPC1.P$37(TE) FPC1.P$40(LCM-ID) J1.A8 J1.B8 J2.A8 J2.B8 J5.9(CDN) J11.4 J11.4-4 J11.7 J11.7-7 U1.5(CTS#) U4.3(#INT) U4.7(CLK_OUT) U5.28(IO35) U5.29(IO36) U5.30(IO37) U8.1(1_NC1) U8.11(11_NO4) U8.12(12_COM4) U8.13(13_NC4) U8.15(15_NO1) U8.16(16_COM1)

## Notes on the sheet
- USB interface | Automatic download circuit
- ESP32-S3-N16R8
- LCD touch screen
- BOOT
- HIG: SPI Boot
- LOW: Download Boot
- RESET
- HIG: ESP32 Enable
- LOW: ESP32 Off
- Weld R3, R4 is OTG
  Weld R35, R36 for RP2040 download
- Battery and control | 3V3 voltage regulator | Passive buzzer
- TF card | Wireless module
- UART & I2C & GPIO extensions
- RTC clock
- Charge indicator control
- I2S MIC
- Indicator lights for power and 
  charging
- Power amplifier
- Power
- Right channel
- V1.2

## Library data of the parts
B1 = CrowPanel_Advance_HMI:BEEP_5025
BT1 = CR1220:CR1220: Coin Cell Smt Horizontal Insul Check availability <https://pricing.snapeda.com/parts/S8411-45R/Harwin/view-part?ref=eda>; AVAILABILITY: In Stock; CHECK_PRICES: https://www.snapeda.com/parts/S8411-45R/Harwin+Inc./view-part/?ref=eda; DESCRIPTION: Coin Cell Battery Retainer, Horizontal SMT, for CR1220 Coin Cell Batteries, Tape & Reeled; MF: Harwin; MP: S8411-45R; PACKAGE: None; PRICE: None; PURCHASE-URL: https://www.snapeda.com/api/url_track_click_mouser/?unipart_id=424412&manufacturer=Harwin&part_name=S8411-45R&search_term=cr1220; SNAPEDA_LINK: https://www.snapeda.com/parts/S8411-45R/Harwin+Inc./view-part/?ref=snap
C1-C18 C20 C21 C31-C34 C36 C48 C49 = CrowPanel_Advance_HMI:CAP*
D1 D2 D4 D5 D10-D13 = CrowPanel_Advance_HMI:DIODE*
D6 = KT-0603RYG:KT-0603RYG: Check availability <https://pricing.snapeda.com/parts/KT-0603R/Hubei%20KENTO%20Elec/view-part?ref=eda>
D14 = CrowPanel_Advance_HMI:LED-SMT*
FB1-FB5 = CrowPanel_Advance_HMI:FB*
FPC1 = CrowPanel_Advice_HMI 4.3:3.5-TFT-FPC-40PIN-0.5MM
FPC2 = CrowPanel_Advance_HMI:FPC-6PIN-0.5MM
J1 J2 = CrowPanel_Advance_HMI:TYPEC-3.0-16P-SMD
J3 = CrowPanel_Advance_HMI:PH2.0WT-2PIN
J4 J6-J8 = CrowPanel_Advance_HMI:THO-M3.2*5MM-HOLE
J5 = CrowPanel_Advance_HMI:HOLDER-MICROSD-9P
J9 J11 = CrowPanel_Advance_HMI:HEADER-7P
J10 = CrowPanel_Advance_HMI:XH2.54-4P-SMT
J12 = CrowPanel_Advance_HMI:WAFER-PH2.0-2PLB
J13 J15 = CrowPanel_Advance_HMI:CONNECTOR_TWIG-4P-2.0-SMD-FEMALE-REINFORCE
J14 = Mini PC Case:HC-PZ200-8.7L-1X4PZ
K3 K4 = CrowPanel_Advance_HMI:KEY-6
L2 L3 = CrowPanel_Advance_HMI:L*
MIC1 = MMICT5838-00-012:LMD3526B261-OFA03
P1-P13 P15-P28 P30-P32 P38-P42 P44-P47 P49-P53 P55-P64 = CrowPanel_Advance_HMI:TEST_PAD*
Q1 Q2 = CrowPanel_Advance_HMI:MOSFET-N*: IRLL014: http://www.vishay.com/docs/91319/sihll014.pdf
Q3 Q7 Q8 Q11 = CrowPanel_Advance_HMI:MOSFET-P: IRLL014: http://www.vishay.com/docs/91319/sihll014.pdf
Q4 Q6 Q12 = CrowPanel_Advance_HMI:TRANS_NPN: NPN transistor Current controlled devices typically used to amplify current or used as a switch. BC547 - COM-08928 <http://www.sparkfun.com/products/8928> (TO-92 45V 100mA) (1.Collector 2.Base 3.Emitter) 2N3904 - COM-00521 <http://www.sparkfun.com/products/521> (TO-92 40V 200mA) (1.Emitter 2.Base 3.Collector) P2N2222A - COM-12852 <http://www.sparkfun.com/products/12852> (TO-92 40V 600mA) (1.Collector 2.Base 3.Emitter)
Q5 = BAT54C-7-F:BAT54C-7-F
Q9 = AO3400A:AO3400A: 30V N-Channel MOSFET Source: Datasheet <http://aosmd.com/res/data_sheets/AO3400A.pdf>; ARROW_PART_NUMBER: AO3400A; ARROW_PRICE-STOCK: https://www.arrow.com/en/products/ao3400a/alpha-and-omega-semiconductor?utm_currency=USD&region=nac; DESCRIPTION: 30V N-Channel MOSFET; HEIGHT: 1.25mm; MANUFACTURER_NAME: Alpha & Omega Semiconductors; MANUFACTURER_PART_NUMBER: AO3400A
Q10 = CrowPanel_Advance_HMI:TRANS_PNP: PNP transistor Current controlled devices typically used to amplify current or used as a switch. SparkFun Products: SparkFun Serial Enabled 16x2 LCD - Red on Black <https://www.sparkfun.com/products/9068> SparkFun Logomatic <https://www.sparkfun.com/products/12772>
R1-R71 = CrowPanel_Advance_HMI:RES*
U1 = sale:CH340K
U2 = CrowPanel_Advance_HMI:TP4059-SOT23-6
U3 = CrowPanel_Advance_HMI:HM3416H
U4 = BM8563:BM8563EMA
U5 = CrowPanel_Advance_HMI:ESP32-S3-WROOM-1
U7 = STC_MCUSTC8G1K08A:NS4168-ESOP-8
U8 = cooper:IC_SGM3799_TQFN2.6X1.8_16L
U10 = UMH3NTN:UMH3NTN: Dual NPN BJT with 4.7K Base resistor Datasheet <https://fscdn.rohm.com/en/products/databook/datasheet/discrete/transistor/digital/umh3ntn-e.pdf> BUY NOW <https://www.digikey.ca/en/products/detail/rohm-semiconductor/umh3ntn/659279> Check availability <https://pricing.snapeda.com/parts/UMH3NTN/Rohm/view-part?ref=eda>; AVAILABILITY: In Stock; CHECK_PRICES: https://www.snapeda.com/parts/UMH3NTN/Rohm/view-part/?ref=eda; DESCRIPTION: Pre-Biased Bipolar Transistor (BJT) 2 NPN - Pre-Biased (Dual) 50V 100mA 250MHz 150mW Surface Mount UMT6; MF: Rohm; MP: UMH3NTN; PACKAGE: SOT-363 Rohm; PRICE: None; PURCHASE-URL: https://www.snapeda.com/api/url_track_click_mouser/?unipart_id=355768&manufacturer=Rohm&part_name=UMH3NTN&search_term=umh3n; SNAPEDA_LINK: https://www.snapeda.com/parts/UMH3NTN/Rohm/view-part/?ref=snap
U14 = DFN8:STC8G1K08
Y1 = Crystal:32.768KHZ: Check availability <https://pricing.snapeda.com/parts/CM7V-T1A-32.768kHz-12.5pF-100PPM-TB-QC/Micro%20Crystal/view-part?ref=eda>; AVAILABILITY: In Stock; CHECK_PRICES: https://www.snapeda.com/parts/CM7V-T1A-32.768kHz-12.5pF-100PPM-TB-QC/Micro+Crystal/view-part/?ref=eda; DESCRIPTION: Tuning Fork Crystal 32.768kHz in SMD 1.5 x 3.2 mm package; MF: Micro Crystal; MP: CM7V-T1A-32.768kHz-12.5pF-100PPM-TB-QC; PACKAGE: SMD-2 Micro Crystal; PRICE: None; PURCHASE-URL: https://www.snapeda.com/api/url_track_click_mouser/?unipart_id=4216772&manufacturer=Micro Crystal&part_name=CM7V-T1A-32.768kHz-12.5pF-100PPM-TB-QC&search_term=crystal; SNAPEDA_LINK: https://www.snapeda.com/parts/CM7V-T1A-32.768kHz-12.5pF-100PPM-TB-QC/Micro+Crystal/view-part/?ref=snap